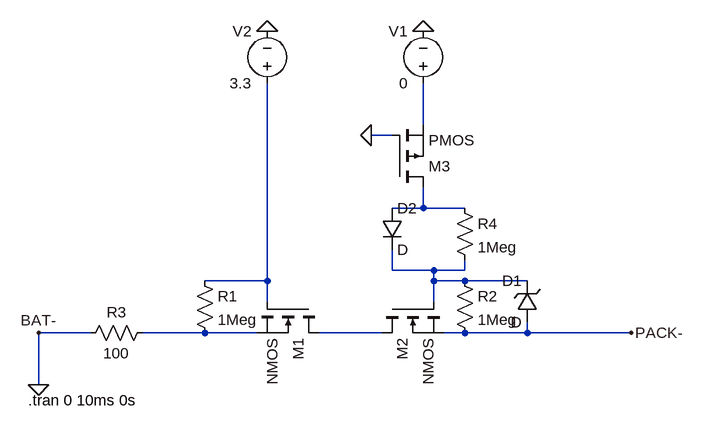
[diagram p0: schematic CHGDSGcircuitry.asc]
CHGDSGcircuitry.asc, the LTspice schematic file:
Version 4
SHEET 1 880 680
WIRE 256 48 256 -16
WIRE 208 64 176 64
WIRE 256 176 256 144
WIRE 256 176 208 176
WIRE 320 176 256 176
WIRE 208 272 208 240
WIRE 272 272 208 272
WIRE 320 272 320 256
WIRE 320 272 272 272
WIRE 16 288 16 -16
WIRE 16 288 -80 288
WIRE 272 288 272 272
WIRE 320 288 272 288
WIRE 416 288 320 288
WIRE 16 320 16 288
WIRE 272 320 272 288
WIRE -256 368 -336 368
WIRE -80 368 -176 368
WIRE 0 368 -80 368
WIRE 192 368 96 368
WIRE 320 368 288 368
WIRE 416 368 416 352
WIRE 416 368 320 368
WIRE 576 368 416 368
WIRE -336 448 -336 368
FLAG -336 448 0
FLAG 176 64 0
FLAG 256 -96 0
FLAG 16 -96 0
FLAG -336 368 BAT-
FLAG 576 368 PACK-
SYMBOL nmos 96 320 R90
SYMATTR InstName M1
SYMBOL nmos 192 320 M90
SYMATTR InstName M2
SYMBOL res -96 272 R0
SYMATTR InstName R1
SYMATTR Value 1Meg
SYMBOL res 304 272 R0
SYMATTR InstName R2
SYMATTR Value 1Meg
SYMBOL zener 432 352 R180
WINDOW 0 24 64 Left 2
WINDOW 3 24 0 Left 2
SYMATTR InstName D1
SYMBOL res -160 352 R90
WINDOW 0 0 56 VBottom 2
WINDOW 3 32 56 VTop 2
SYMATTR InstName R3
SYMATTR Value 100
SYMBOL pmos 208 144 M180
SYMATTR InstName M3
SYMBOL res 304 160 R0
SYMATTR InstName R4
SYMATTR Value 1Meg
SYMBOL diode 192 176 R0
SYMATTR InstName D2
SYMBOL voltage 256 0 R180
WINDOW 0 24 96 Left 2
WINDOW 3 24 16 Left 2
WINDOW 123 0 0 Left 0
WINDOW 39 0 0 Left 0
SYMATTR InstName V1
SYMATTR Value 0
SYMBOL voltage 16 0 R180
WINDOW 0 24 96 Left 2
WINDOW 3 24 16 Left 2
WINDOW 123 0 0 Left 0
WINDOW 39 0 0 Left 0
SYMATTR InstName V2
SYMATTR Value 3.3
TEXT -352 472 Left 2 !.tran 0 10ms 0s

The netlist it stands for:
* CHGDSGcircuitry.asc
M1 N006 N004 N005 N005 NMOS
M2 N006 N003 PACK- PACK- NMOS
R1 N004 N005 1Meg
R2 N003 PACK- 1Meg
D1 PACK- N003 D
R3 N005 0 100
M3 N002 0 N001 N001 PMOS
R4 N002 N003 1Meg
D2 N002 N003 D
V1 N001 0 0
V2 N004 0 3.3
.model D D
.lib standard.dio
.model NMOS NMOS
.model PMOS PMOS
.lib standard.mos
.tran 0 10ms 0s
.backanno
.end